# Altium schematic sheet TSE_commutation_board.SchDoc
size 420 x 297 mm; SheetNumber: 1; SheetTotal: 1
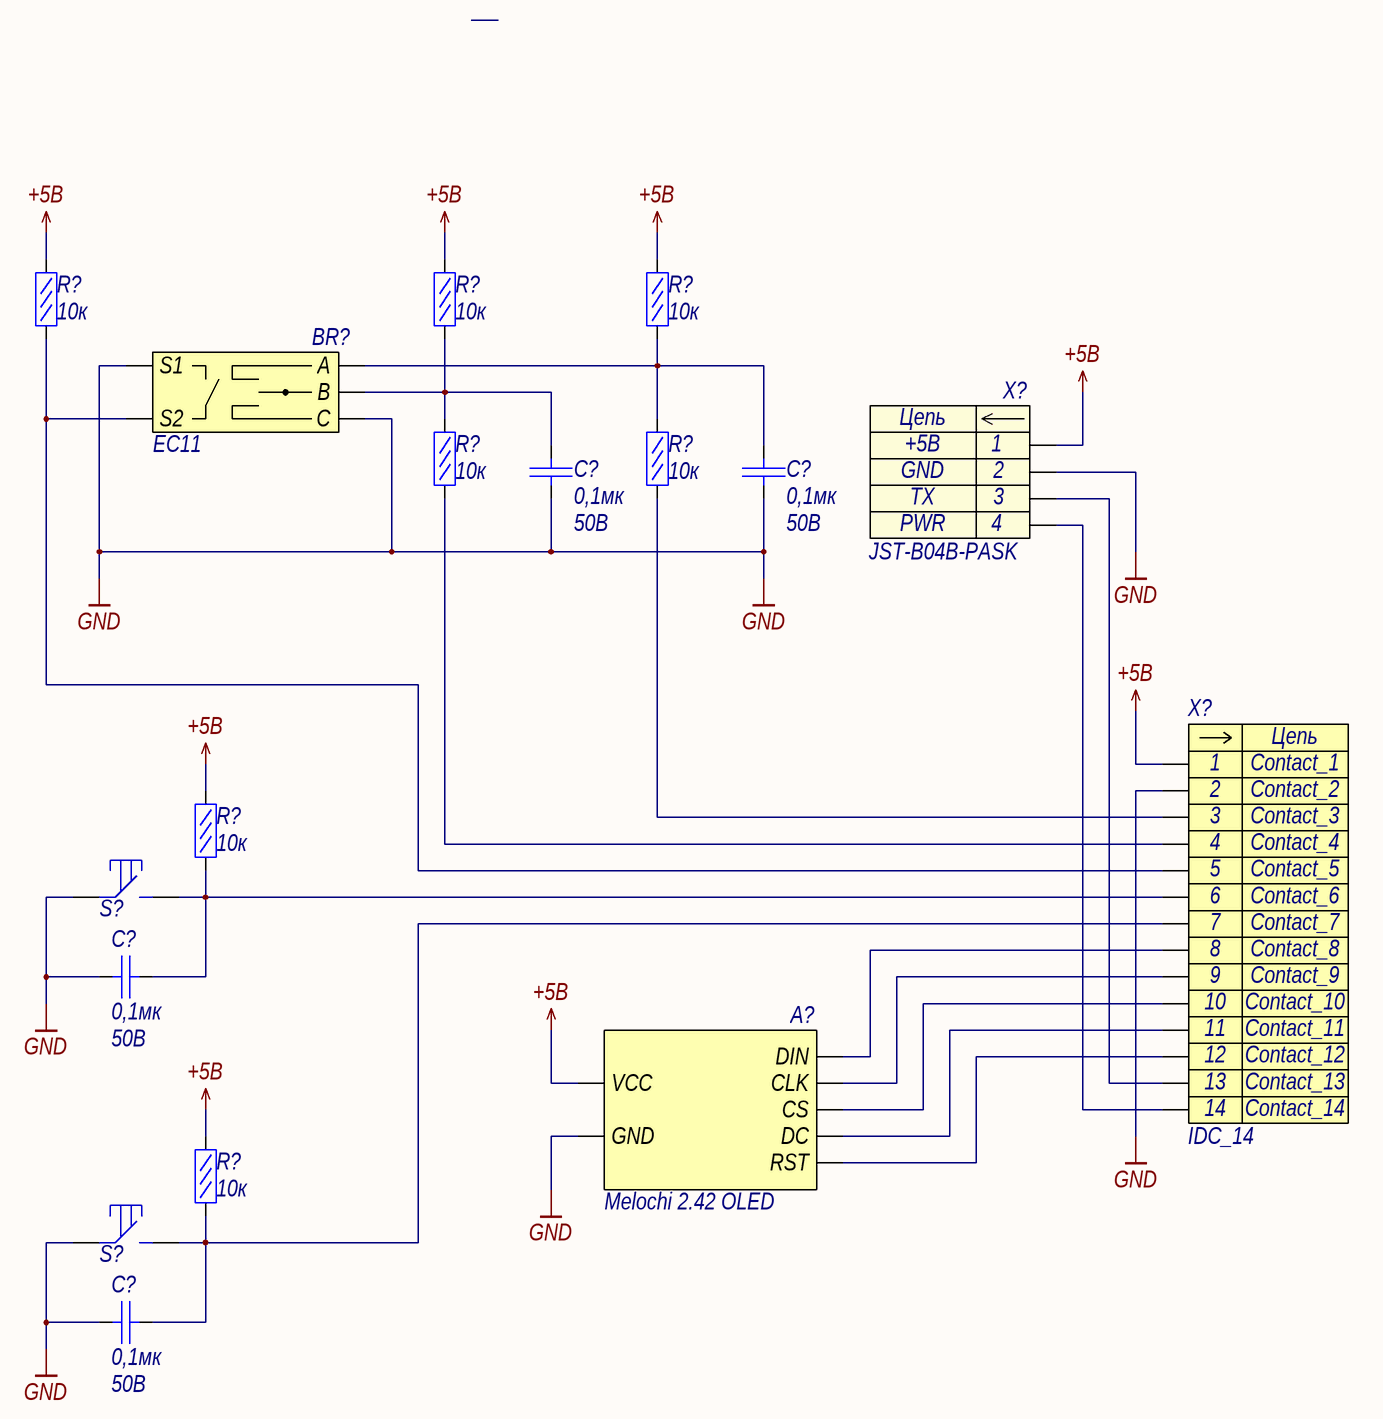
[diagram p0: TSE_commutation_board.SchDoc]

## Parts
(Parts that share a designator on the sheet are numbered #1, #2 ... from top to bottom, then left to right.)
A?  Melochi 2.42 OLED
BR?  EC11
C?#1  Voltage: 50В  [C0603]  (hidden comment: 0,1мк)
C?#2  Voltage: 50В  [C0603]  (hidden comment: 0,1мк)
C?#3  Voltage: 50В  [C0603]  (hidden comment: 0,1мк)
C?#4  Voltage: 50В  [C0603]  (hidden comment: 0,1мк)
R?#1  10к  [R0603]
R?#2  10к  [R0603]
R?#3  10к  [R0603]
R?#4  10к  [R0603]
R?#5  10к  [R0603]
R?#6  10к  [R0603]
R?#7  10к  [R0603]
S?#1  IT-1187  [it-1187]  (value not drawn)
S?#2  IT-1187  [it-1187]  (value not drawn)
X?#1  JST-B04B-PASK
X?#2  IDC_14  [IDC1.27_14]

## Nets
+5В: A?.1(VCC) R?#1.2 R?#2.2 R?#3.2 R?#6.2 R?#7.2 X?#1.1 X?#2.1
GND: A?.2(GND) BR?.1(S1) BR?.5(C) C?#1.1 C?#2.1 C?#3.1 C?#4.1 S?#1.1 S?#2.1 X?#1.2 X?#2.2
NetA?_3: A?.3(DIN) X?#2.8
NetA?_4: A?.4(CLK) X?#2.9
NetA?_5: A?.5(CS) X?#2.10
NetA?_5: A?.5(DC) X?#2.11  [a separate net that carries the same name]
NetA?_5: A?.5(RST) X?#2.12  [a separate net that carries the same name]
NetBR?_2: BR?.2(S2) R?#1.1 X?#2.5
NetBR?_3: BR?.3(A) C?#2.2 R?#3.1 R?#5.2
NetBR?_4: BR?.4(B) C?#1.2 R?#2.1 R?#4.2
NetC?#3_2: C?#3.2 R?#6.1 S?#1.2 X?#2.6
NetC?#4_2: C?#4.2 R?#7.1 S?#2.2 X?#2.7
NetR?#4_1: R?#4.1 X?#2.4
NetR?#5_1: R?#5.1 X?#2.3
NetX?#1_1: X?#1.1 X?#2.14
NetX?#1_2: X?#1.2 X?#2.13

## Notes on the sheet
- Перв. примен.
- Справ. №
- Подп. и дата
- Инв. № дубл.
- Взам. инв. №
- Изм.
- Лист
- № докум.
- Подп.
- Дата
- Лит.
- Масса
- Масштаб
- Т.контр.
- Пров.
- Разраб.
- Листов
- Инв. № подл.
- Н.контр.
- Файл:
- Утв.
- Копировал
- Формат
- (in symbol IDC_14) Цепь
- (in symbol JST-B04B-PASK) Цепь; 3; 4

## Library data of the parts
A? = Melochi 2.42 OLED: OLED дисплей 2.42 дюйма; Наименование: Melochi 2.42 OLED
BR? = EC11: Энкодер с кнопкой; Наименование: EC11
C?#1-C?#4 = CC0603JPX7R9BB104: Конденсатор кер. 0,1мкФ 50В; Manufacturer: Yageo; TKE: X7R; Name: CC0603JPX7R9BB104; Value: 0,1мк
R?#1-R?#7 = RC0603FR-0710KL: Резистор 10кОм 0,063Вт 1%; Manufacturer: YAGEO; Name: RC0603FR-0710KL; Tolerance: 1%; Value: 10к
S?#1 S?#2 = IT-1187: тактовая кнопка SMD; Name: IT-1187
X?#1 = JST-B04B-PASK: Разъем - 4 конт. прямая вилка на плату, шаг 2,00 мм; Contact_1: +5В; Contact_2: GND; Contact_3: TX; Contact_4: PWR; Наименование: JST-B04B-PASK
X?#2 = IDC_14: Разъем - 14 конт. прямая вилка на плату; Наименование: IDC_14; Contact_1: Contact_1; Contact_2: Contact_2; Contact_3: Contact_3; Contact_4: Contact_4; Contact_5: Contact_5; Contact_6: Contact_6; Contact_7: Contact_7; Contact_8: Contact_8; Contact_9: Contact_9; Contact_10: Contact_10; Contact_11: Contact_11; Contact_12: Contact_12; Contact_13: Contact_13; Contact_14: Contact_14